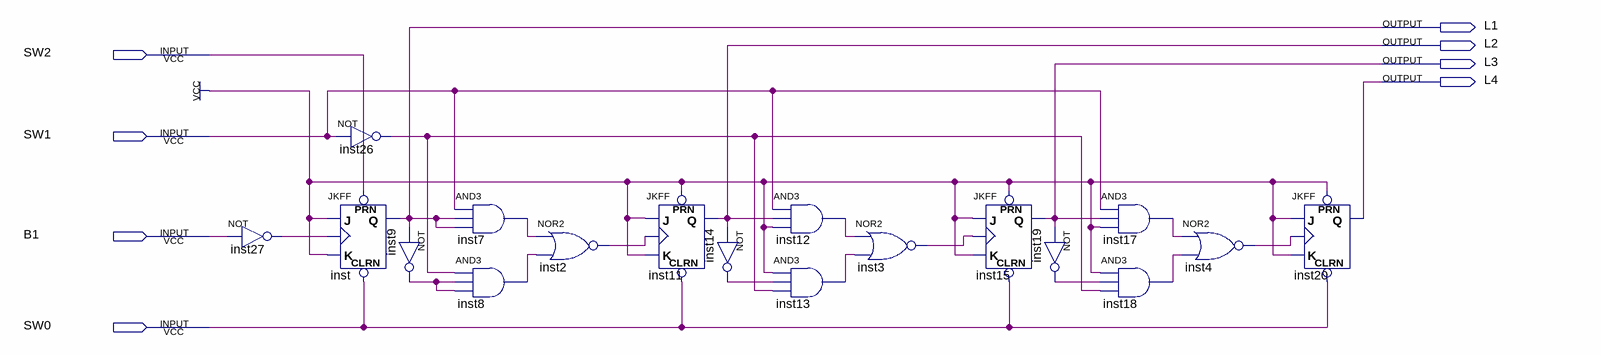
[diagram p0: schematic sheet]
// Quartus schematic AsynBinUp.bdf as structural Verilog: 18 symbols, 8 pins
module AsynBinUp (
  input  SW2,
  input  SW1,
  input  B1,
  input  SW0,
  output L1,
  output L2,
  output L3,
  output L4
);

  wire inst2_out, inst3_out, inst4_out, inst7_out, inst8_out, inst9_out, inst12_out, inst13_out, inst14_out,
       inst17_out, inst18_out, inst19_out, inst26_out, inst27_out;

  not inst27 (inst27_out, B1);
  JKFF inst (.PRN(SW2), .CLRN(SW0), .K(1'b1), .J(1'b1), .CLK(inst27_out), .Q(L1));
  not inst26 (inst26_out, SW1);
  not inst9 (inst9_out, L1);
  and inst7 (inst7_out, SW1, L1, L1);
  and inst8 (inst8_out, inst26_out, inst9_out, inst9_out);
  nor inst2 (inst2_out, inst7_out, inst8_out);
  JKFF inst11 (.PRN(1'b1), .CLRN(SW0), .K(1'b1), .J(1'b1), .CLK(inst2_out), .Q(L2));
  not inst14 (inst14_out, L2);
  and inst12 (inst12_out, SW1, L2, 1'b1);
  and inst13 (inst13_out, 1'b1, inst14_out, inst26_out);
  nor inst3 (inst3_out, inst12_out, inst13_out);
  JKFF inst15 (.PRN(1'b1), .CLRN(SW0), .K(1'b1), .J(1'b1), .CLK(inst3_out), .Q(L3));
  not inst19 (inst19_out, L3);
  and inst17 (inst17_out, SW1, L3, 1'b1);
  and inst18 (inst18_out, 1'b1, inst19_out, inst26_out);
  nor inst4 (inst4_out, inst17_out, inst18_out);
  JKFF inst20 (.PRN(1'b1), .CLRN(SW0), .K(1'b1), .J(1'b1), .CLK(inst4_out), .Q(L4));
endmodule
